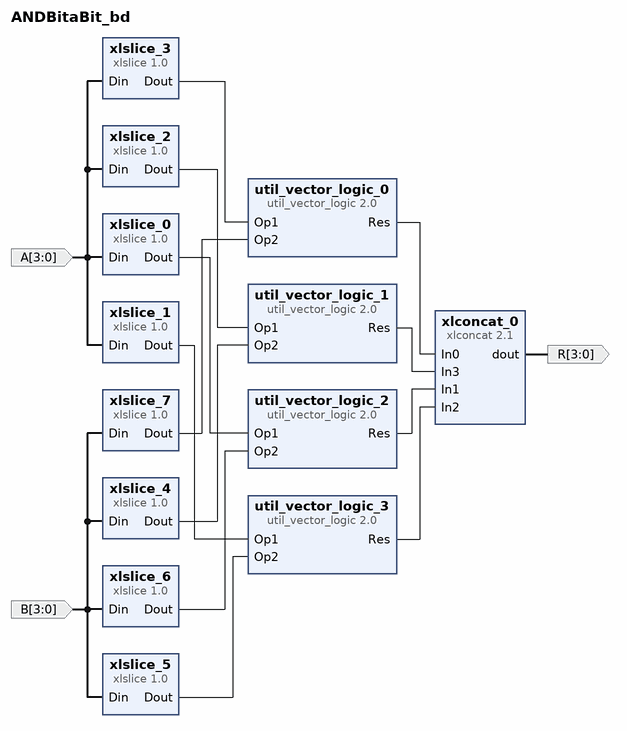
[diagram p0: block diagram of the top level]
# Vivado block design ANDBitaBit_bd, xc7a35ticpg236-1L, Vivado 2023.2
create_bd_design ANDBitaBit_bd

create_bd_port -dir I -from 3 -to 0 A
create_bd_port -dir I -from 3 -to 0 B
create_bd_port -dir O -from 3 -to 0 R

create_bd_cell -type ip -vlnv xilinx.com:ip:xlslice:1.0 xlslice_0
set_property -dict {CONFIG.DIN_TO 2 CONFIG.DIN_WIDTH 4} [get_bd_cells xlslice_0]
create_bd_cell -type ip -vlnv xilinx.com:ip:xlslice:1.0 xlslice_1
set_property -dict {CONFIG.DIN_FROM 1 CONFIG.DIN_TO 1 CONFIG.DIN_WIDTH 4} [get_bd_cells xlslice_1]
create_bd_cell -type ip -vlnv xilinx.com:ip:xlslice:1.0 xlslice_2
set_property -dict {CONFIG.DIN_FROM 0 CONFIG.DIN_TO 0 CONFIG.DIN_WIDTH 4} [get_bd_cells xlslice_2]
create_bd_cell -type ip -vlnv xilinx.com:ip:xlslice:1.0 xlslice_3
set_property -dict {CONFIG.DIN_FROM 3 CONFIG.DIN_TO 3 CONFIG.DIN_WIDTH 4} [get_bd_cells xlslice_3]
create_bd_cell -type ip -vlnv xilinx.com:ip:xlslice:1.0 xlslice_4
set_property -dict {CONFIG.DIN_TO 2 CONFIG.DIN_WIDTH 4} [get_bd_cells xlslice_4]
create_bd_cell -type ip -vlnv xilinx.com:ip:xlslice:1.0 xlslice_5
set_property -dict {CONFIG.DIN_FROM 1 CONFIG.DIN_TO 1 CONFIG.DIN_WIDTH 4} [get_bd_cells xlslice_5]
create_bd_cell -type ip -vlnv xilinx.com:ip:xlslice:1.0 xlslice_6
set_property -dict {CONFIG.DIN_FROM 0 CONFIG.DIN_TO 0 CONFIG.DIN_WIDTH 4} [get_bd_cells xlslice_6]
create_bd_cell -type ip -vlnv xilinx.com:ip:xlslice:1.0 xlslice_7
set_property -dict {CONFIG.DIN_FROM 3 CONFIG.DIN_TO 3 CONFIG.DIN_WIDTH 4} [get_bd_cells xlslice_7]
create_bd_cell -type ip -vlnv xilinx.com:ip:util_vector_logic:2.0 util_vector_logic_0
set_property -dict {CONFIG.C_SIZE 1} [get_bd_cells util_vector_logic_0]
create_bd_cell -type ip -vlnv xilinx.com:ip:util_vector_logic:2.0 util_vector_logic_1
set_property -dict {CONFIG.C_SIZE 1} [get_bd_cells util_vector_logic_1]
create_bd_cell -type ip -vlnv xilinx.com:ip:util_vector_logic:2.0 util_vector_logic_2
set_property -dict {CONFIG.C_SIZE 1} [get_bd_cells util_vector_logic_2]
create_bd_cell -type ip -vlnv xilinx.com:ip:util_vector_logic:2.0 util_vector_logic_3
set_property -dict {CONFIG.C_SIZE 1} [get_bd_cells util_vector_logic_3]
create_bd_cell -type ip -vlnv xilinx.com:ip:xlconcat:2.1 xlconcat_0
set_property -dict {CONFIG.NUM_PORTS 4} [get_bd_cells xlconcat_0]

# ---- connections ----

connect_bd_net [get_bd_ports A] [get_bd_pins xlslice_3/Din] [get_bd_pins xlslice_0/Din] [get_bd_pins xlslice_1/Din] [get_bd_pins xlslice_2/Din]
connect_bd_net [get_bd_ports B] [get_bd_pins xlslice_7/Din] [get_bd_pins xlslice_6/Din] [get_bd_pins xlslice_5/Din] [get_bd_pins xlslice_4/Din]
connect_bd_net [get_bd_pins util_vector_logic_0/Res] [get_bd_pins xlconcat_0/In0]
connect_bd_net [get_bd_pins util_vector_logic_1/Res] [get_bd_pins xlconcat_0/In3]
connect_bd_net [get_bd_pins util_vector_logic_2/Res] [get_bd_pins xlconcat_0/In1]
connect_bd_net [get_bd_pins util_vector_logic_3/Res] [get_bd_pins xlconcat_0/In2]
connect_bd_net [get_bd_pins xlconcat_0/dout] [get_bd_ports R]
connect_bd_net [get_bd_pins xlslice_0/Dout] [get_bd_pins util_vector_logic_2/Op1]
connect_bd_net [get_bd_pins xlslice_1/Dout] [get_bd_pins util_vector_logic_3/Op1]
connect_bd_net [get_bd_pins xlslice_2/Dout] [get_bd_pins util_vector_logic_1/Op1]
connect_bd_net [get_bd_pins xlslice_3/Dout] [get_bd_pins util_vector_logic_0/Op1]
connect_bd_net [get_bd_pins xlslice_4/Dout] [get_bd_pins util_vector_logic_1/Op2]
connect_bd_net [get_bd_pins xlslice_5/Dout] [get_bd_pins util_vector_logic_3/Op2]
connect_bd_net [get_bd_pins xlslice_6/Dout] [get_bd_pins util_vector_logic_2/Op2]
connect_bd_net [get_bd_pins xlslice_7/Dout] [get_bd_pins util_vector_logic_0/Op2]

validate_bd_design
save_bd_design
